# Altium schematic sheet CUBE3TX.SchDoc
size A3
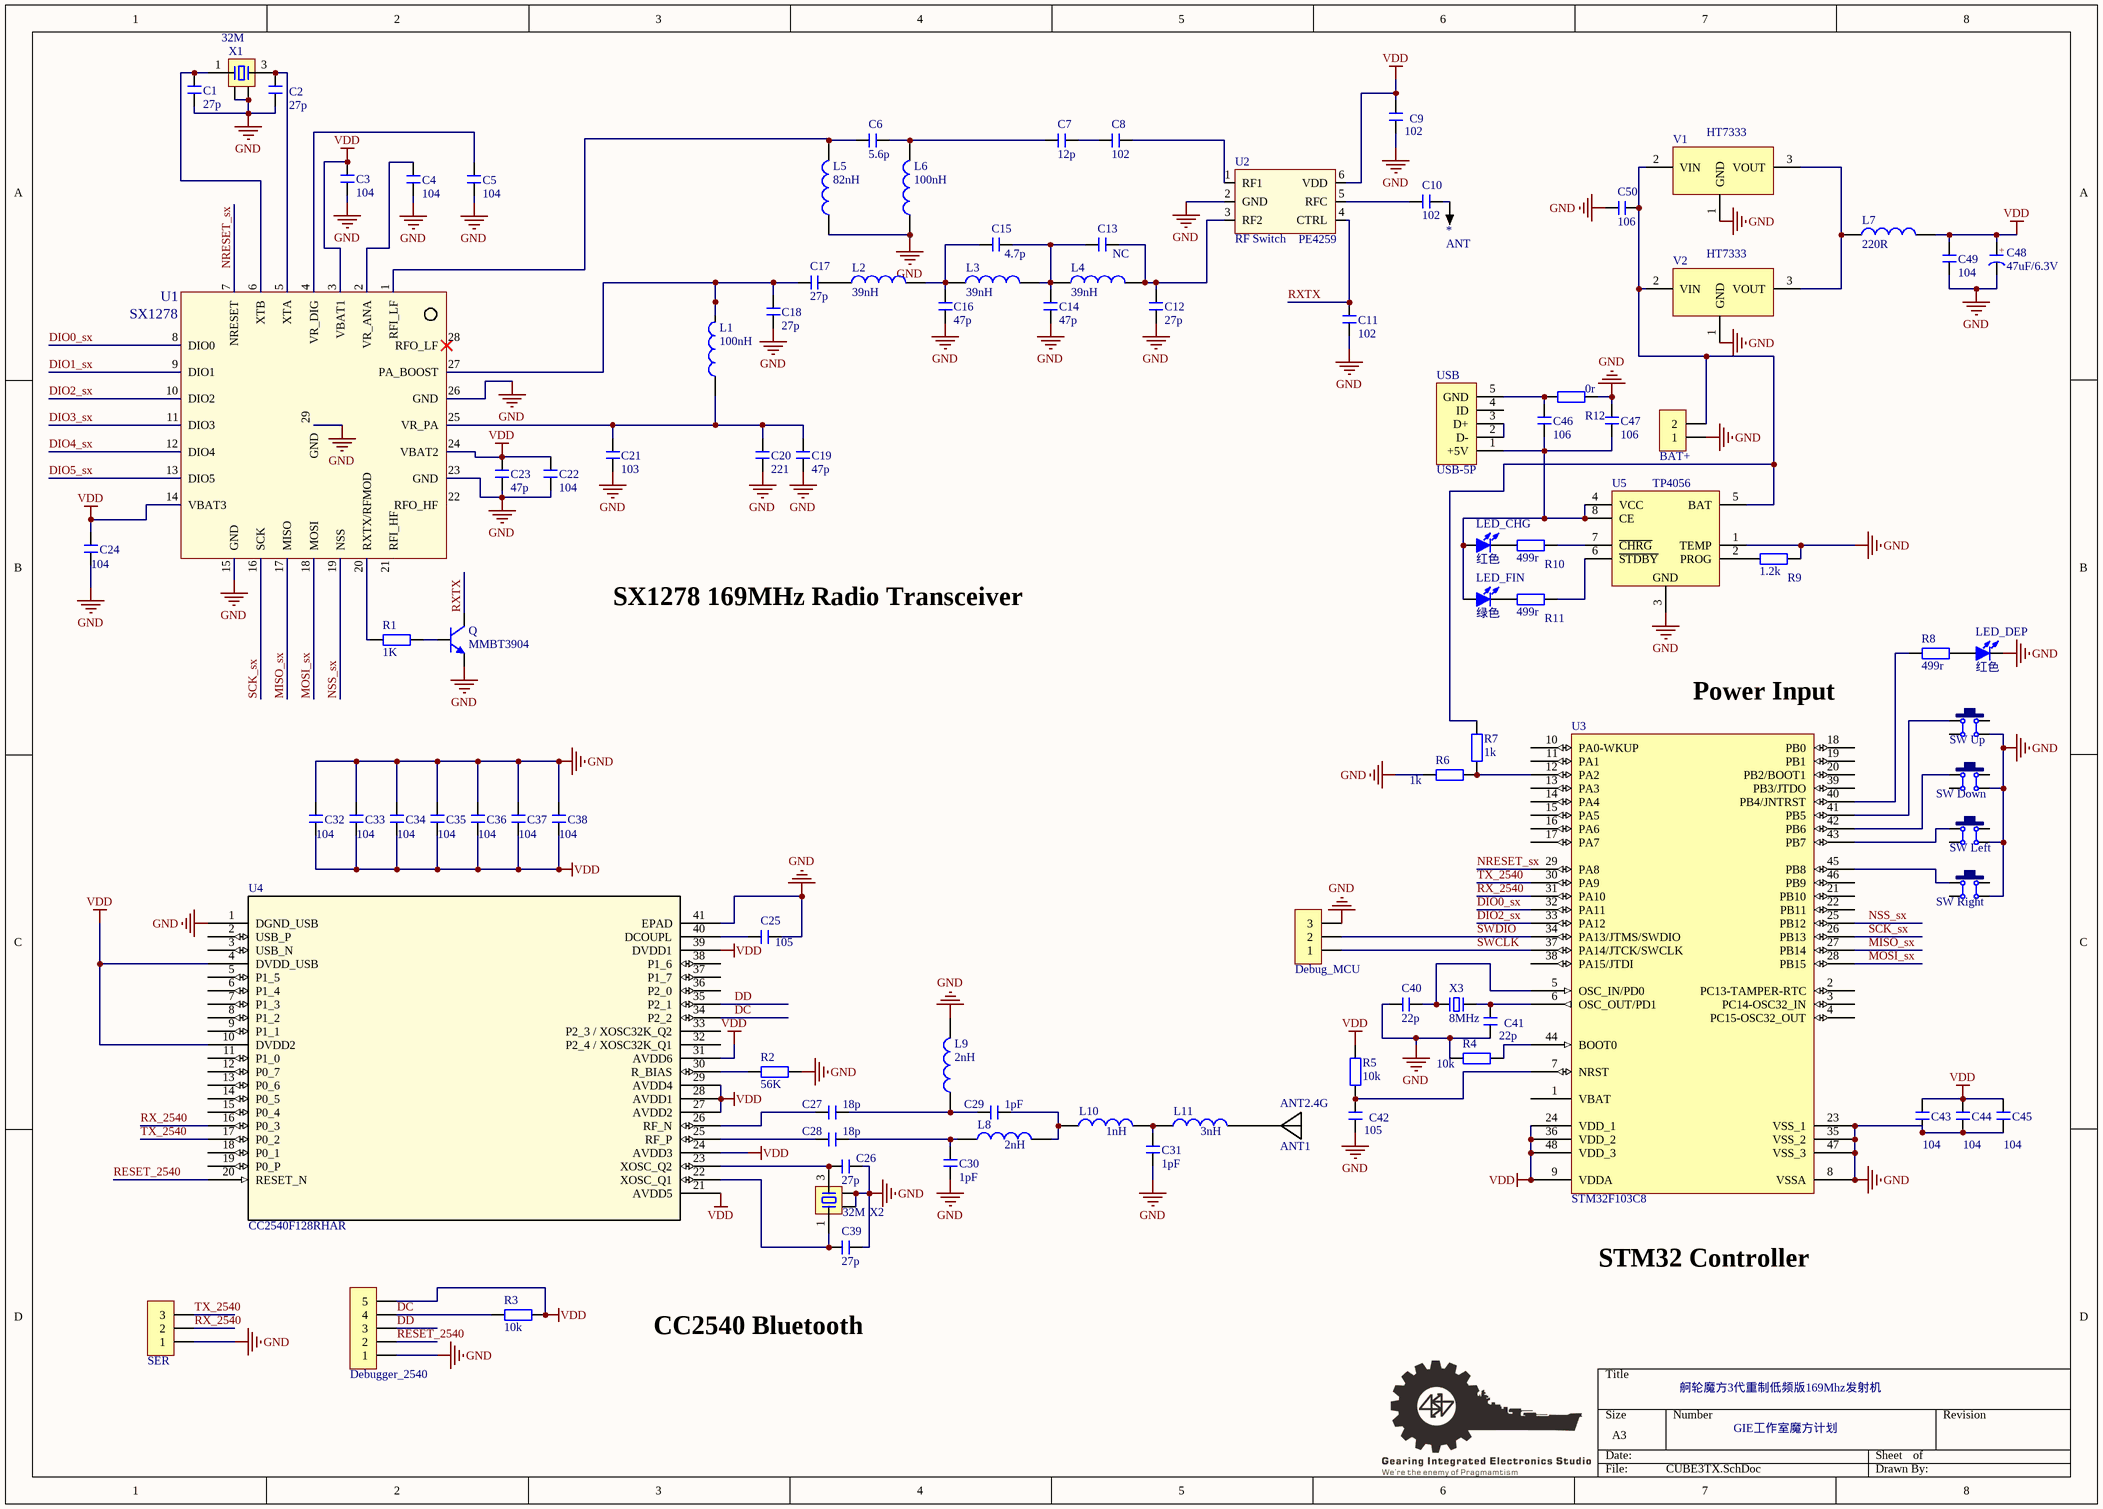
[diagram p0: CUBE3TX.SchDoc]

## Parts
*  ANT  [R100]
ANT2.4G  ANT1  [Ant2_4]
BAT+  HDR-1X2  [HDR2.54-LI-2P]  (value not drawn)
C1  27p  [C 0603_L]
C2  27p  [C 0603_L]
C3  104  [C 0603_L]
C4  104  [C 0603_L]
C5  104  [C 0603_L]
C6  5.6p  [C 0402_L]
C7  12p  [C 0402_L]
C8  102  [C 0402_L]
C9  102  [C 0402_L]
C10  102  [C 0402_L]
C11  102  [C 0402_L]
C12  27p  [C 0402_L]
C13  NC  [C 0402_L]
C14  47p  [C 0402_L]
C15  4.7p  [C 0402_L]
C16  47p  [C 0402_L]
C17  27p  [C 0402_L]
C18  27p  [C 0402_L]
C19  47p  [C 0402_L]
C20  221  [C 0402_L]
C21  103  [C 0603_L]
C22  104  [C 0603_L]
C23  47p  [C 0402_L]
C24  104  [C 0603_L]
C25  105  [C 0402_L]
C26  27p  [C 0603_L]
C27  18p  [C 0603_L]
C28  18p  [C 0603_L]
C29  1pF  [C 0603_L]
C30  1pF  [C 0603_L]
C31  1pF  [C 0603_L]
C32  104  [C 0603_L]
C33  104  [C 0603_L]
C34  104  [C 0603_L]
C35  104  [C 0603_L]
C36  104  [C 0603_L]
C37  104  [C 0603_L]
C38  104  [C 0603_L]
C39  27p  [C 0603_L]
C40  22p  [C 0603_L]
C41  22p  [C 0603_L]
C42  105  [C 0603_L]
C43  104  [C 0603_L]
C44  104  [C 0603_L]
C45  104  [C 0603_L]
C46  106  [C 0805_L]
C47  106  [C 0805_L]
C48  47uF/6.3V  [CD A(3216)]
C49  104  [C 0603_L]
C50  106  [C 0805_L]
Debug_MCU  HDR-1X3  [HDR2.54-LI-3P]  (value not drawn)
Debugger_2540  HDR-1X5  [HDR2.54-LI-5P]  (value not drawn)
L1  100nH  [L 0402]
L2  39nH  [L 0402]
L3  39nH  [L 0402]
L4  39nH  [L 0402]
L5  82nH  [L 0402]
L6  100nH  [L 0402]
L7  220R  [L 0805]
L8  2nH  [L 0603]
L9  2nH  [L 0603]
L10  1nH  [L 0603]
L11  3nH  [L 0603]
LED_CHG  红色  [LED 0603B]
LED_DEP  红色  [LED 0603B]
LED_FIN  绿色  [LED 0603B]
Q  MMBT3904  [SOT23-3N]
R1  1K  [R 0603_L]
R2  56K  [R 0603_L]
R3  10k  [R 0603_L]
R4  10k  [R 0603_L]
R5  10k  [R 0603_L]
R6  1k  [R 0603_L]
R7  1k  [R 0603_L]
R8  499r  [R 0603_L]
R9  1.2k  [R 0603_L]
R10  499r  [R 0603_L]
R11  499r  [R 0603_L]
R12  0r  [R 1206_L]
SER  HDR-1X3  [HDR2.54-LI-3P]  (value not drawn)
SW_Down  6x6x5  [TSW DIP-6*6*6]  (value not drawn)
SW_Left  6x6x5  [TSW DIP-6*6*6]  (value not drawn)
SW_Right  6x6x5  [TSW DIP-6*6*6]  (value not drawn)
SW_Up  6x6x5  [TSW DIP-6*6*6]  (value not drawn)
U1  SX1278  [vqfn28_6x6mm]
U2  RF Switch  value PE4259  [SC70-6]
U3  STM32F103C8  [LQFP48 7X7_M]
U4  CC2540F128RHAR  [VQFN10X4-40PIN]
U5  TP4056  [SOP8_N]
USB  USB-5P  [USB-MICRO_A]
V1  HT7333  [SOT89_N]
V2  HT7333  [SOT89_N]
X1  32M  [OSC 3225-4P]
X2  32M  [OSC 3225-4P]
X3  8MHz  [OSC 5032-2P]

## Nets
GND: BAT+.1 C1.1 C2.1 C3.1 C4.1 C5.1 C9.1 C11.1 C12.1 C14.1 C16.1 C18.1 C19.1 C20.1 C21.1 C22.1 C23.1 C24.1 C25.2 C26.1 C30.2 C31.2 C32.2 C33.2 C34.2 C35.2 C36.2 C37.2 C38.2 C39.1 C40.1 C41.2 C42.2 C43.1 C44.1 C45.1 C47.1 C48.2(K) C49.2 C50.1 Debug_MCU.3 Debugger_2540.1 L5.1 L6.1 L9.2 LED_DEP.2(K) Q.2(E) R2.2 R4.2 R6.2 R9.2 R12.2 SER.1 SW_Down.3 SW_Left.3 SW_Right.3 SW_Up.3 U1.15(GND) U1.23(GND) U1.26(GND) U1.29(GND) U2.2(GND) U3.8(VSSA) U3.23(VSS_1) U3.35(VSS_2) U3.47(VSS_3) U4.1(DGND_USB) U4.41(EPAD) U5.1(TEMP) U5.3(GND) V1.1(GND) V2.1(GND) X1.2 X1.4 X2.2 X2.4
VDD: C3.2 C9.2 C22.2 C23.2 C24.2 C32.1 C33.1 C34.1 C35.1 C36.1 C37.1 C38.1 C43.2 C44.2 C45.2 C48.1(A) C49.1 Debugger_2540.5 L7.2 R3.1 R5.2 U1.3(VBAT1) U1.14(VBAT3) U1.24(VBAT2) U2.6(VDD) U3.9(VDDA) U3.24(VDD_1) U3.36(VDD_2) U3.48(VDD_3) U4.4(DVDD_USB) U4.10(DVDD2) U4.21(AVDD5) U4.24(AVDD3) U4.27(AVDD2) U4.28(AVDD1) U4.29(AVDD4) U4.31(AVDD6) U4.39(DVDD1)
DC: Debugger_2540.4 R3.2 U4.34(P2_2)
DD: Debugger_2540.3 U4.35(P2_1)
DIO0_sx: U1.8(DIO0) U3.32(PA11)
DIO1_sx: U1.9(DIO1)
DIO2_sx: U1.10(DIO2) U3.33(PA12)
DIO3_sx: U1.11(DIO3)
DIO4_sx: U1.12(DIO4)
DIO5_sx: U1.13(DIO5)
MISO_sx: U1.17(MISO) U3.27(PB14)
MOSI_sx: U1.18(MOSI) U3.28(PB15)
NRESET_sx: U1.7(NRESET) U3.29(PA8)
NSS_sx: U1.19(NSS) U3.25(PB12)
RESET_2540: Debugger_2540.2 U4.20(RESET_N)
RX_2540: SER.2 U3.31(PA10) U4.16(P0_3)
RXTX: C11.2 Q.3(C) U2.4(CTRL)
SCK_sx: U1.16(SCK) U3.26(PB13)
SWCLK: Debug_MCU.1 U3.37(PA14/JTCK/SWCLK)
SWDIO: Debug_MCU.2 U3.34(PA13/JTMS/SWDIO)
TX_2540: SER.3 U3.30(PA9) U4.17(P0_2)
Net*_1: *.1 C10.2
NetANT2.4G_1: ANT2.4G.1 L11.2
NetBAT+_2: BAT+.2 C50.2 R7.1 U5.5(BAT) V1.2(VIN) V2.2(VIN)
NetC1_2: C1.2 U1.6(XTB) X1.1
NetC2_2: C2.2 U1.5(XTA) X1.3
NetC4_2: C4.2 U1.2(VR_ANA)
NetC5_2: C5.2 U1.4(VR_DIG)
NetC6_1: C6.1 L5.2 U1.1(RFI_LF)
NetC6_2: C6.2 C7.1 L6.2
NetC7_2: C7.2 C8.1
NetC8_2: C8.2 U2.1(RF1)
NetC10_1: C10.1 U2.5(RFC)
NetC12_2: C12.2 C13.1 L4.2 U2.3(RF2)
NetC13_2: C13.2 C14.2 C15.1 L3.2 L4.1
NetC15_2: C15.2 C16.2 L2.2 L3.1
NetC17_1: C17.1 L2.1
NetC17_2: C17.2 C18.2 L1.2 U1.27(PA_BOOST)
NetC19_2: C19.2 C20.2 C21.2 L1.1 U1.25(VR_PA)
NetC25_1: C25.1 U4.40(DCOUPL)
NetC26_2: C26.2 U4.23(XOSC_Q2) X2.3
NetC27_1: C27.1 C29.2 L9.1
NetC27_2: C27.2 U4.26(RF_N)
NetC28_1: C28.1 C30.1 L8.1
NetC28_2: C28.2 U4.25(RF_P)
NetC29_1: C29.1 L8.2 L10.1
NetC31_1: C31.1 L10.2 L11.1
NetC39_2: C39.2 U4.22(XOSC_Q1) X2.1
NetC40_2: C40.2 U3.5(OSC_IN/PD0) X3.2
NetC41_1: C41.1 U3.6(OSC_OUT/PD1) X3.1
NetC42_1: C42.1 R5.1 U3.7(NRST)
NetC46_1: C46.1 R12.1 USB.5(GND)
NetC46_2: C46.2 C47.2 LED_CHG.1(A) LED_FIN.1(A) U5.4(VCC) U5.8(CE) USB.1(+5V)
NetL7_1: L7.1 V1.3(VOUT) V2.3(VOUT)
NetLED_CHG_2: LED_CHG.2(K) R10.1
NetLED_DEP_1: LED_DEP.1(A) R8.2
NetLED_FIN_2: LED_FIN.2(K) R11.1
NetQ_1: Q.1(B) R1.2
NetR1_1: R1.1 U1.20(RXTX/RFMOD)
NetR2_1: R2.1 U4.30(R_BIAS)
NetR4_1: R4.1 U3.44(BOOT0)
NetR6_1: R6.1 R7.2 U3.12(PA2)
NetR8_1: R8.1 U3.40(PB4/JNTRST)
NetR9_1: R9.1 U5.2(PROG)
NetR10_2: R10.2 U5.7(~{CHRG})
NetR11_2: R11.2 U5.6(~{STDBY})
NetSW_Down_1: SW_Down.1 U3.42(PB6)
NetSW_Left_1: SW_Left.1 U3.43(PB7)
NetSW_Right_1: SW_Right.1 U3.45(PB8)
NetSW_Up_1: SW_Up.1 U3.41(PB5)
NetUSB_2: USB.2(D-) USB.3(D+)

Not connected (* = marked no-connect by the designer): SW_Down 2 4; SW_Left 2 4; SW_Right 2 4; SW_Up 2 4; U1 21(RFI_HF) 22(RFO_HF) 28(RFO_LF)*; U3 1(VBAT) 2(PC13-TAMPER-RTC) 3(PC14-OSC32_IN) 4(PC15-OSC32_OUT) 10(PA0-WKUP) 11(PA1) 13(PA3) 14(PA4) 15(PA5) 16(PA6) 17(PA7) 18(PB0) 19(PB1) 20(PB2/BOOT1) 21(PB10) 22(PB11) 38(PA15/JTDI) 39(PB3/JTDO) 46(PB9); U4 2(USB_P) 3(USB_N) 5(P1_5) 6(P1_4) 7(P1_3) 8(P1_2) 9(P1_1) 11(P1_0) 12(P0_7) 13(P0_6) 14(P0_5) 15(P0_4) 18(P0_1) 19(P0_P) 32(P2_4_/_XOSC32K_Q1) 33(P2_3_/_XOSC32K_Q2) 36(P2_0) 37(P1_7) 38(P1_6); USB 4(ID)

## Notes on the sheet
- SX1278 169MHz Radio Transceiver
- (near U3) Power Input
- STM32 Controller
- CC2540 Bluetooth
- 舸轮魔方3代重制低频版169Mhz发射机
- GIE工作室魔方计划
- (in symbol C-CD) +

## Library data of the parts
* = CS: 探针焊盘; 版权归属: 源创客; BOM名称: 探针焊盘; 学习资源: www.ooocke.com
ANT2.4G = ANT1: PCB板载天线; 版权归属: 源创客; BOM名称: PCB板载天线; 学习资源: www.ooocke.com
BAT+ = Header 2: 2P接插件; 版权归属: 源创客; BOM名称: 2P接插件; 学习资源: www.ooocke.com
C1-C47 C49 C50 = C: 无极性贴片电容; 版权归属: 源创客; BOM名称: 无极性贴片电容; 学习资源: www.ooocke.com
C48 = C-CD: 贴片钽电容; 版权归属: 源创客; BOM名称: 贴片钽电容; 学习资源: www.ooocke.com
Debug_MCU SER = Header 3: 3P接插件; 版权归属: 源创客; BOM名称: 3P接插件; 学习资源: www.ooocke.com
Debugger_2540 = Header 5: 5P接插件; 版权归属: 源创客; BOM名称: 5P接插件; 学习资源: www.ooocke.com
L1-L11 = L: 小功率贴片电感; 版权归属: 源创客; BOM名称: 小功率贴片电感; 学习资源: www.ooocke.com
LED_CHG LED_DEP LED_FIN = LED-SMD: 贴片LED; 版权归属: 源创客; BOM名称: 贴片LED; 学习资源: www.ooocke.com
Q = 8050-SMD: 高频放大-NPN型; 版权归属: 源创客; 属性: 40V 1.5A 1W 100MHZ; BOM名称: 高频放大-NPN型; 学习资源: www.ooocke.com
R1-R12 = R: 贴片电阻; 版权归属: 源创客; BOM名称: 贴片电阻; 学习资源: www.ooocke.com
SW_Down SW_Left SW_Right SW_Up = TSW DIP-6x6: 直插6x6轻触开关; 版权归属: 源创客; BOM名称: 直插6x6轻触开关; 学习资源: www.ooocke.com
U1 = SX1276: SX1276 - Low Power Integrated UHF Transceiver with loRa Modem; LatestRevisionDate: 27-Jul-2009 -  Semtech
U2 = PE4259 RF Switch: PE4259 Peregrine RF Switch; LatestRevisionDate: 03-Sep-2012 -  Semtech
U3 = STM32F103C8: Flaah:64/RAM:20/IO:36; BOM名称: 32位STM单片机; 版权归属: 源创客; 学习资源: www.ooocke.com
U4 = CC2540F128RHAR: 2.4GHz Bluetooth Low Energy System-on-Chip Solution; Manufacturer: Texas Instruments; GENERIC_PART_NUMBER: CC2540; INDUSTRY_STD_PKG_TYPE: VQFN; FAMILY_NAME: Bluetooth Low Energy Technology; PIN_COUNT: 40; PACKAGE_DESIGNATOR: RHA; Datasheet_URL: http://www.ti.com/lit/gpn/CC2540; Copyright: Copyright (C) 2018 Accelerated Designs. All rights reserved; RefDes: RefDes; Type: DEV; Value: Value
U5 = TP4056: 锂电池充电管理; 版权归属: 源创客; BOM名称: 锂电池充电管理; 学习资源: www.ooocke.com
USB = USB-5P: 微型USB母座; 版权归属: 源创客; BOM名称: 微型USB母座; 学习资源: www.ooocke.com
V1 V2 = HT71xx: LDO线性稳压芯片; 版权归属: 源创客; BOM名称: LDO线性稳压芯片; 学习资源: www.ooocke.com
X1 X2 = XTAL-4P: 4脚无源晶振; 版权归属: 源创客; BOM名称: 4脚无源晶振; 学习资源: www.ooocke.com
X3 = XTAL-2P: 2脚无源脚晶振; 版权归属: 源创客; BOM名称: 2脚无源脚晶振; 学习资源: www.ooocke.com